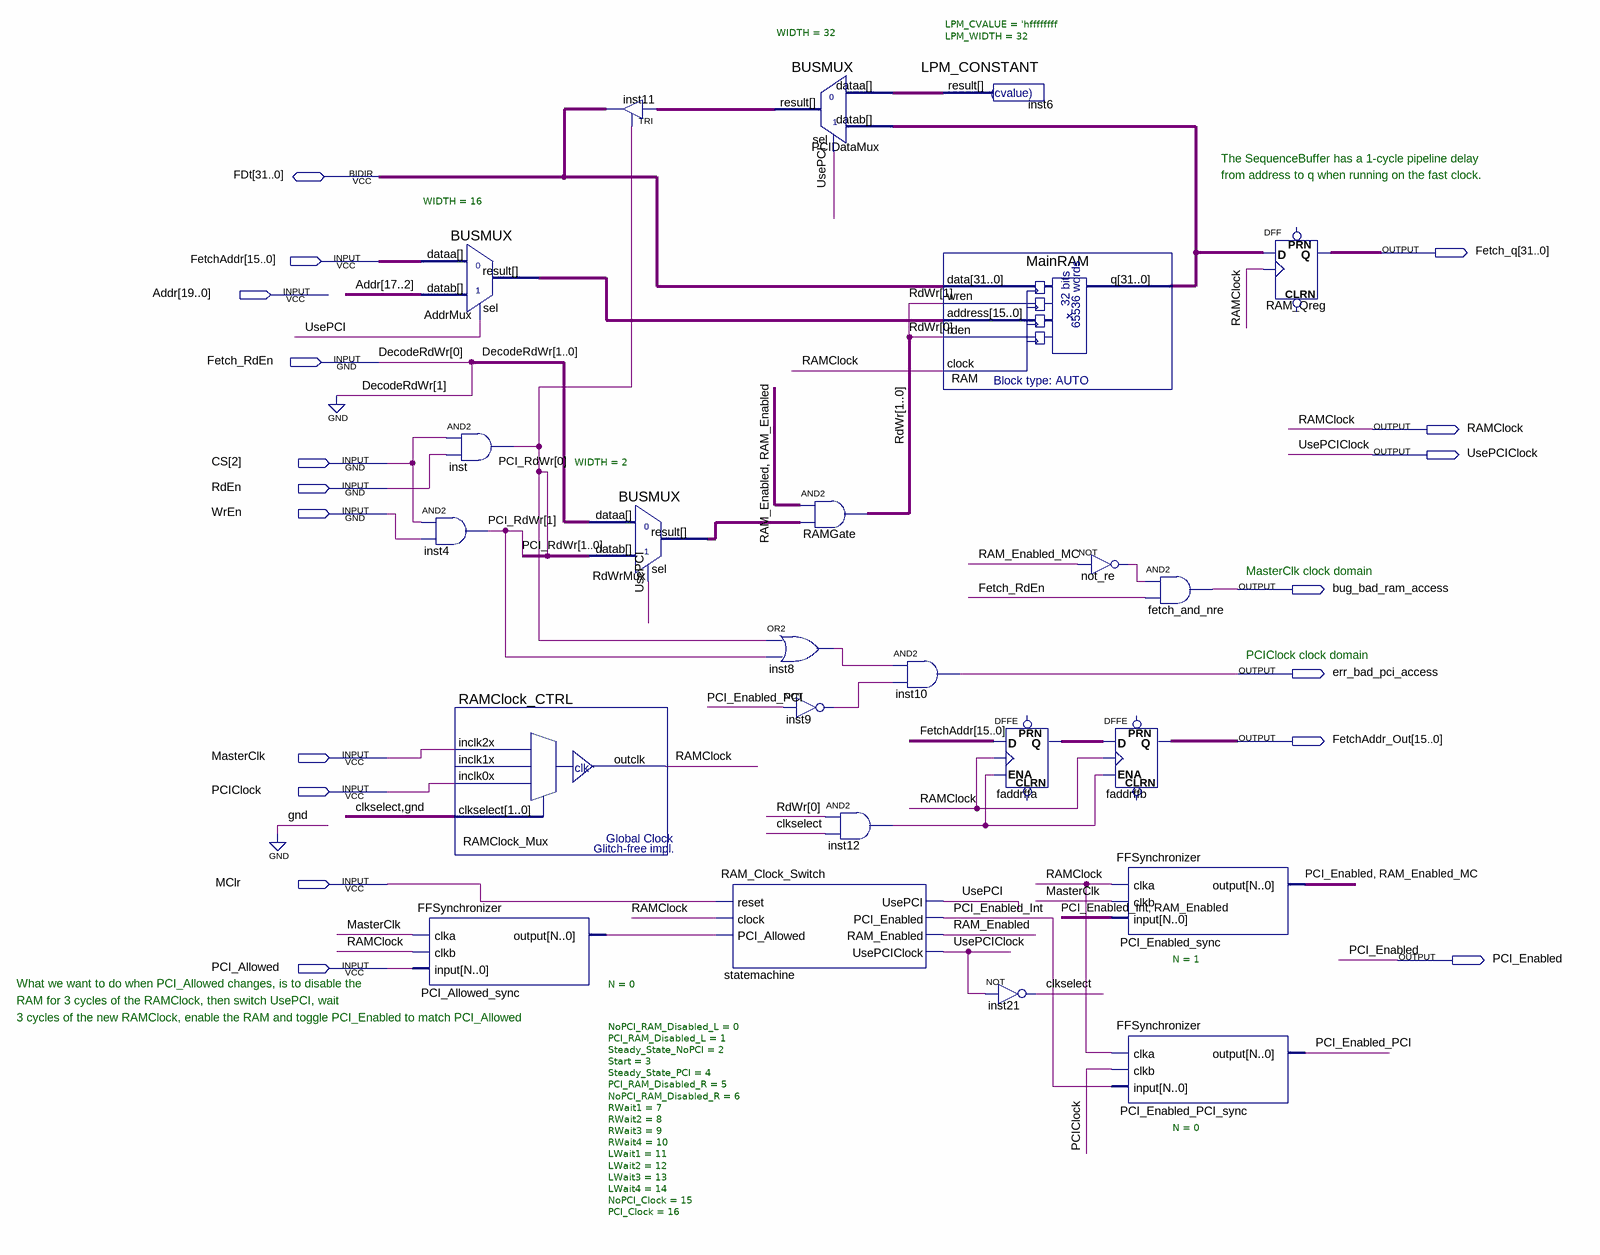
[diagram p0: schematic sheet]
// Quartus schematic SequenceBuffer.bdf as structural Verilog: 24 symbols, 18 pins
module SequenceBuffer (
  input  [15:0] FetchAddr,
  input  [19:0] Addr,
  input  Fetch_RdEn,
  input  [2:2] CS,
  input  RdEn,
  input  WrEn,
  input  MasterClk,
  input  PCIClock,
  input  MClr,
  input  PCI_Allowed,
  inout  [31:0] FDt,
  output [31:0] Fetch_q,
  output RAMClock,
  output UsePCIClock,
  output bug_bad_ram_access,
  output err_bad_pci_access,
  output [15:0] FetchAddr_Out,
  output PCI_Enabled
);

  wire clkselect, inst8_out, inst9_out, inst12_out, not_re_out, PCI_Allowed_sync_output, PCI_Enabled_Int,
       PCI_Enabled_PCI, RAM_Enabled, RAM_Enabled_MC, UsePCI;
  wire [1:0] PCI_RdWr, RdWr, RdWrMux_result;
  wire [15:0] AddrMux_result, faddrffa_q;
  wire [31:0] inst6_result, PCIDataMux_result, RAM_q;

  BUSMUX #(.WIDTH(16)) AddrMux (.datab(Addr[17:2]), .sel(UsePCI), .dataa(FetchAddr), .result(AddrMux_result));
  and inst4 (PCI_RdWr[1], CS[2], WrEn);
  FFSynchronizer #(.N(0)) PCI_Allowed_sync (
    .clka(MasterClk), .clkb(RAMClock), .\input (PCI_Allowed), .\output (PCI_Allowed_sync_output));
  and inst (PCI_RdWr[0], CS[2], RdEn);
  RAMClock_CTRL RAMClock_Mux (
    .clkselect({clkselect, 1'b0}), .inclk2x(MasterClk), .inclk0x(PCIClock), .outclk(RAMClock));  // open: inclk1x
  TRI inst11[31:0] (.IN(PCIDataMux_result), .OE(PCI_RdWr[0]), .OUT(FDt));
  BUSMUX #(.WIDTH(2)) RdWrMux (.datab(PCI_RdWr), .sel(UsePCI), .dataa({1'b0, Fetch_RdEn}), .result(RdWrMux_result));
  or inst8 (inst8_out, PCI_RdWr[0], PCI_RdWr[1]);
  RAM_Clock_Switch #(.NoPCI_RAM_Disabled_L(0), .PCI_RAM_Disabled_L(1), .Steady_State_NoPCI(2), .Start(3), .Steady_State_PCI(4), .PCI_RAM_Disabled_R(5), .NoPCI_RAM_Disabled_R(6), .RWait1(7), .RWait2(8), .RWait3(9), .RWait4(10), .LWait1(11), .LWait2(12), .LWait3(13), .LWait4(14), .NoPCI_Clock(15), .PCI_Clock(16)) statemachine (
    .reset(MClr), .clock(RAMClock), .PCI_Allowed(PCI_Allowed_sync_output), .UsePCI(UsePCI),
    .PCI_Enabled(PCI_Enabled_Int), .RAM_Enabled(RAM_Enabled), .UsePCIClock(UsePCIClock));
  BUSMUX #(.WIDTH(32)) PCIDataMux (.datab(RAM_q), .sel(UsePCI), .dataa(inst6_result), .result(PCIDataMux_result));
  assign RdWr = {2{RAM_Enabled}} & RdWrMux_result;  // AND2 RAMGate, 2 bits wide
  not inst9 (inst9_out, PCI_Enabled_PCI);
  and inst12 (inst12_out, RdWr[0], clkselect);
  and inst10 (err_bad_pci_access, inst8_out, inst9_out);
  LPM_CONSTANT #(.LPM_CVALUE('hffffffff), .LPM_WIDTH(32)) inst6 (.result(inst6_result));
  MainRAM RAM (.data(FDt), .wren(RdWr[1]), .address(AddrMux_result), .rden(RdWr[0]), .clock(RAMClock), .q(RAM_q));
  DFFE faddrffa[15:0] (.D(FetchAddr), .CLK(RAMClock), .ENA(inst12_out), .Q(faddrffa_q));  // open: PRN, CLRN
  not inst21 (clkselect, UsePCIClock);
  not not_re (not_re_out, RAM_Enabled_MC);
  DFFE faddrffb[15:0] (.D(faddrffa_q), .CLK(RAMClock), .ENA(inst12_out), .Q(FetchAddr_Out));  // open: PRN, CLRN
  and fetch_and_nre (bug_bad_ram_access, not_re_out, Fetch_RdEn);
  FFSynchronizer #(.N(1)) PCI_Enabled_sync (
    .clka(RAMClock), .clkb(MasterClk), .\input ({PCI_Enabled_Int, RAM_Enabled}),
    .\output ({PCI_Enabled, RAM_Enabled_MC}));
  FFSynchronizer #(.N(0)) PCI_Enabled_PCI_sync (
    .clka(RAMClock), .clkb(PCIClock), .\input (PCI_Enabled_Int), .\output (PCI_Enabled_PCI));
  DFF RAM_Qreg[31:0] (.CLK(RAMClock), .D(RAM_q), .Q(Fetch_q));  // open: CLRN, PRN

  // Other names for the same wires on the sheet: DecodeRdWr[0] = Fetch_RdEn

  // Notes on the sheet:
  //   The SequenceBuffer has a 1-cycle pipeline delay
  //   from address to q when running on the fast clock.
  //   MasterClk clock domain
  //   PCIClock clock domain
  //   What we want to do when PCI_Allowed changes, is to disable the
  //   RAM for 3 cycles of the RAMClock, then switch UsePCI, wait
  //   3 cycles of the new RAMClock, enable the RAM and toggle PCI_Enabled to match PCI_Allowed
endmodule
